# EAGLE schematic ttl (EAGLE 5.01)
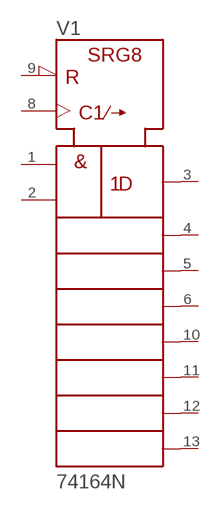
[diagram p0: schematic, sheet 1]

## Parts
V1  74164N  [DIL14]
Unconnected: V1.1(A) V1.2(B) V1.3(QA) V1.4(QB) V1.5(QC) V1.6(QD) V1.8(CLK) V1.9(!CLR) V1.10(QE) V1.11(QF) V1.12(QG) V1.13(QH)

## Power pins joined to a net without a drawn wire
+UB: V1.14(+UB)
-UB: V1.7(-UB)

## Library data of the parts
V1 = 74ttl-din:74*164: 8-bit parallel out SHIFT REGISTER